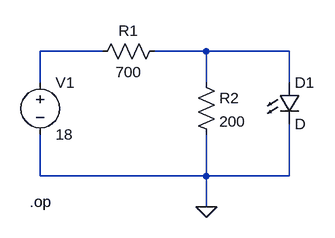
[diagram p0: schematic PD Jack.asc]
PD Jack.asc, the LTspice schematic file:
Version 4
SHEET 1 880 680
WIRE -16 96 -112 96
WIRE 144 96 64 96
WIRE 272 96 144 96
WIRE -112 144 -112 96
WIRE 144 144 144 96
WIRE 272 144 272 96
WIRE -112 288 -112 224
WIRE 144 288 144 224
WIRE 144 288 -112 288
WIRE 272 288 272 208
WIRE 272 288 144 288
WIRE 144 336 144 288
FLAG 144 336 0
SYMBOL LED 256 144 R0
SYMATTR InstName D1
SYMBOL res 80 80 R90
WINDOW 0 0 56 VBottom 2
WINDOW 3 32 56 VTop 2
SYMATTR InstName R1
SYMATTR Value 700
SYMBOL res 128 128 R0
SYMATTR InstName R2
SYMATTR Value 200
SYMBOL voltage -112 128 R0
WINDOW 123 0 0 Left 0
WINDOW 39 0 0 Left 0
SYMATTR InstName V1
SYMATTR Value 18
TEXT -128 328 Left 2 !.op

The netlist it stands for:
* PD Jack.asc
D1 N002 0 D
R1 N002 N001 700
R2 N002 0 200
V1 N001 0 18
.model D D
.lib standard.dio
.op
.backanno
.end